# Altium schematic sheet ir-tara-smd.SchDoc
size A3
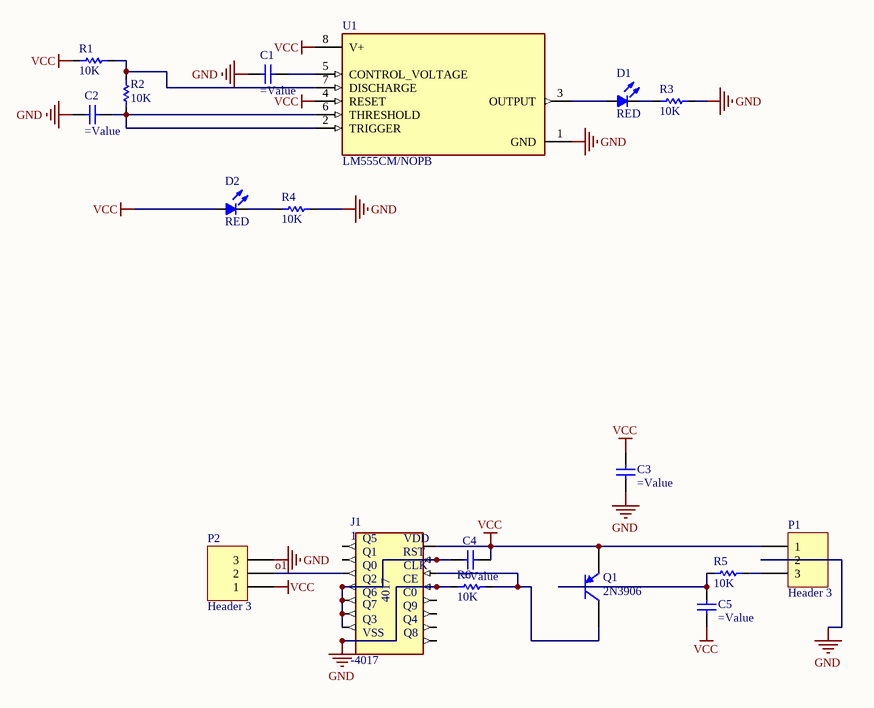
[diagram p0: ir-tara-smd.SchDoc]

## Parts
C1  (no value)  [CAP 1206]
C2  (no value)  [CAP 1206]
C3  (no value)  [CAP 1206]
C4  (no value)  [CAP 1206]
C5  (no value)  [CAP 1206]
D1  COLOR: RED  [LED-5mm]  (hidden comment: MODEL)
D2  COLOR: RED  [LED-5mm]  (hidden comment: MODEL)
J1  -4017  [SOIC127P600X175-16N]
P1  Header 3  [HDR1X3]
P2  Header 3  [HDR1X3]
Q1  2N3906  [SOT23-3]
R1  10K  [RES 1206 (3216X08L)]
R2  10K  [RES 1206 (3216X08L)]
R3  10K  [RES 1206 (3216X08L)]
R4  10K  [RES 1206 (3216X08L)]
R5  10K  [RES 1206 (3216X08L)]
R6  10K  [RES 1206 (3216X08L)]
U1  LM555CM/NOPB  [SOIC127P599X175-8N]

## Nets
GND: C1.2(-) C2.2(-) C3.2(-) J1.8(VSS) J1.13(CE) P1.2 P2.3 R3.2 R4.2 R6.2 U1.1(GND)
VCC: C3.1(+) C4.1(+) C5.2(-) D2.1(A) J1.16(VDD) P1.1 P2.1 Q1.1(E) R1.2 U1.4(RESET) U1.8(V+)
o1: J1.3(Q0) P2.2
NetC1_1: C1.1(+) U1.5(CONTROL_VOLTAGE)
NetC2_1: C2.1(+) R2.1 U1.2(TRIGGER) U1.6(THRESHOLD)
NetC4_2: C4.2(-) J1.4(Q2) J1.5(Q6) J1.6(Q7) J1.7(Q3) J1.15(RST)
NetC5_1: C5.1(+) Q1.2(B) R5.2
NetD1_1: D1.1(A) U1.3(OUTPUT)
NetD1_2: D1.2(K) R3.1
NetD2_2: D2.2(K) R4.1
NetJ1_14: J1.14(CLK) Q1.3(C) R6.1
NetP1_3: P1.3 R5.1
NetR1_1: R1.1 R2.2 U1.7(DISCHARGE)

Not connected (* = marked no-connect by the designer): J1 1(Q5) 2(Q1) 9(Q8) 10(Q4) 11(Q9) 12(C0)

## Library data of the parts
C1-C5 = Capacitor
D1 D2 = LED 5mm: Typical LED
J1 = -4017: 10000pF Â±1% 25V Ceramic Capacitor C0G, NP0 0603 (1608 Metric); MF: Heyco; MP: 4017; Mouser-Purchase-URL: https://snapeda.com/shop?store=Mouser&id=51486; Package: 0603 Heyco; Value: *; Price: None; Availability: Warning; SnapEDA_Link: https://www.snapeda.com/parts/4017/Heyco/view-part/51486/?ref=snap
P1 P2 = Header 3: Header, 3-Pin; LatestRevisionDate: 17-Jul-2002; LatestRevisionNote: Re-released for DXP Platform.; Publisher: Altium Limited
Q1 = 2N3906: PNP General Purpose Amplifier; pin to pad: 1>2 2>1; Published: 8-Jun-2000; LatestRevisionDate: 15-Jan-2003; LatestRevisionNote: PCB Footprint 'BCY-W3/D4.7' replaced; DatasheetVersion: 1997; PackageVersion: Sep-1998; PackageReference: TO-92A; Publisher: Altium Limited; PackageDescription: TO, Flat Index; 3 In-Line, Axial Leads; Body Dia. 4.5mm; Leads 0.51 x 0.48 mm (max); ComponentLink1Description: Manufacturer Link; ComponentLink1URL: http://www.fairchildsemi.com/; ComponentLink2Description: Datasheet; ComponentLink2URL: http://www.fairchildsemi.com/ds/2N%2F2N3906.pdf
R1-R6 = Resistor: Tolerance: 5%; Power: 1/4 W; Value: 10K
U1 = LM555CM/NOPB: Highly Stable 555 Timer 8-SOIC 0 to 70; Price: None; MP: LM555CM/NOPB; Availability: Unavailable; Value: *; Package: None